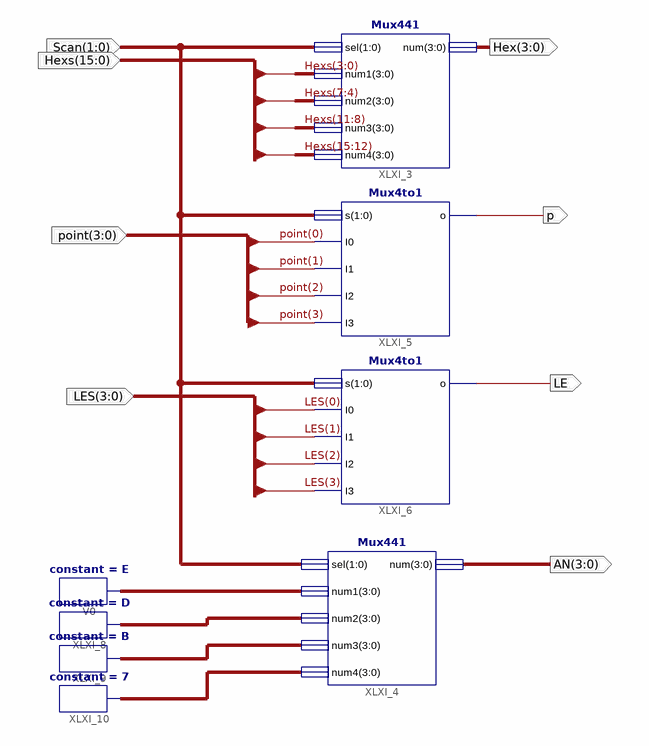
[diagram p0: schematic sheet 1]
// Xilinx ISE schematic Dispsync.sch (spartan3) as structural Verilog: 8 symbols, 8 ports
module Dispsync (
  input  [1:0] Scan,
  input  [15:0] Hexs,
  input  [3:0] point,
  input  [3:0] LES,
  output [3:0] Hex,
  output p,
  output LE,
  output [3:0] AN
);

  wire [3:0] XLXN_21, XLXN_22, XLXN_23, XLXN_24;

  Mux441 XLXI_3 (.sel(Scan), .num1(Hexs[3:0]), .num2(Hexs[7:4]), .num3(Hexs[11:8]), .num4(Hexs[15:12]), .num(Hex));
  Mux441 XLXI_4 (.sel(Scan), .num1(XLXN_21), .num2(XLXN_22), .num3(XLXN_23), .num4(XLXN_24), .num(AN));
  Mux4to1 XLXI_5 (.s(Scan), .I0(point[0]), .I1(point[1]), .I2(point[2]), .I3(point[3]), .o(p));
  Mux4to1 XLXI_6 (.s(Scan), .I0(LES[0]), .I1(LES[1]), .I2(LES[2]), .I3(LES[3]), .o(LE));
  constant #(.CValue("E")) V0 (.O(XLXN_21));
  constant #(.CValue("D")) XLXI_8 (.O(XLXN_22));
  constant #(.CValue("B")) XLXI_9 (.O(XLXN_23));
  constant #(.CValue("7")) XLXI_10 (.O(XLXN_24));
endmodule
